# Altium schematic sheet Sheet1.SchDoc
size A3; SheetNumber: 1; SheetTotal: 1
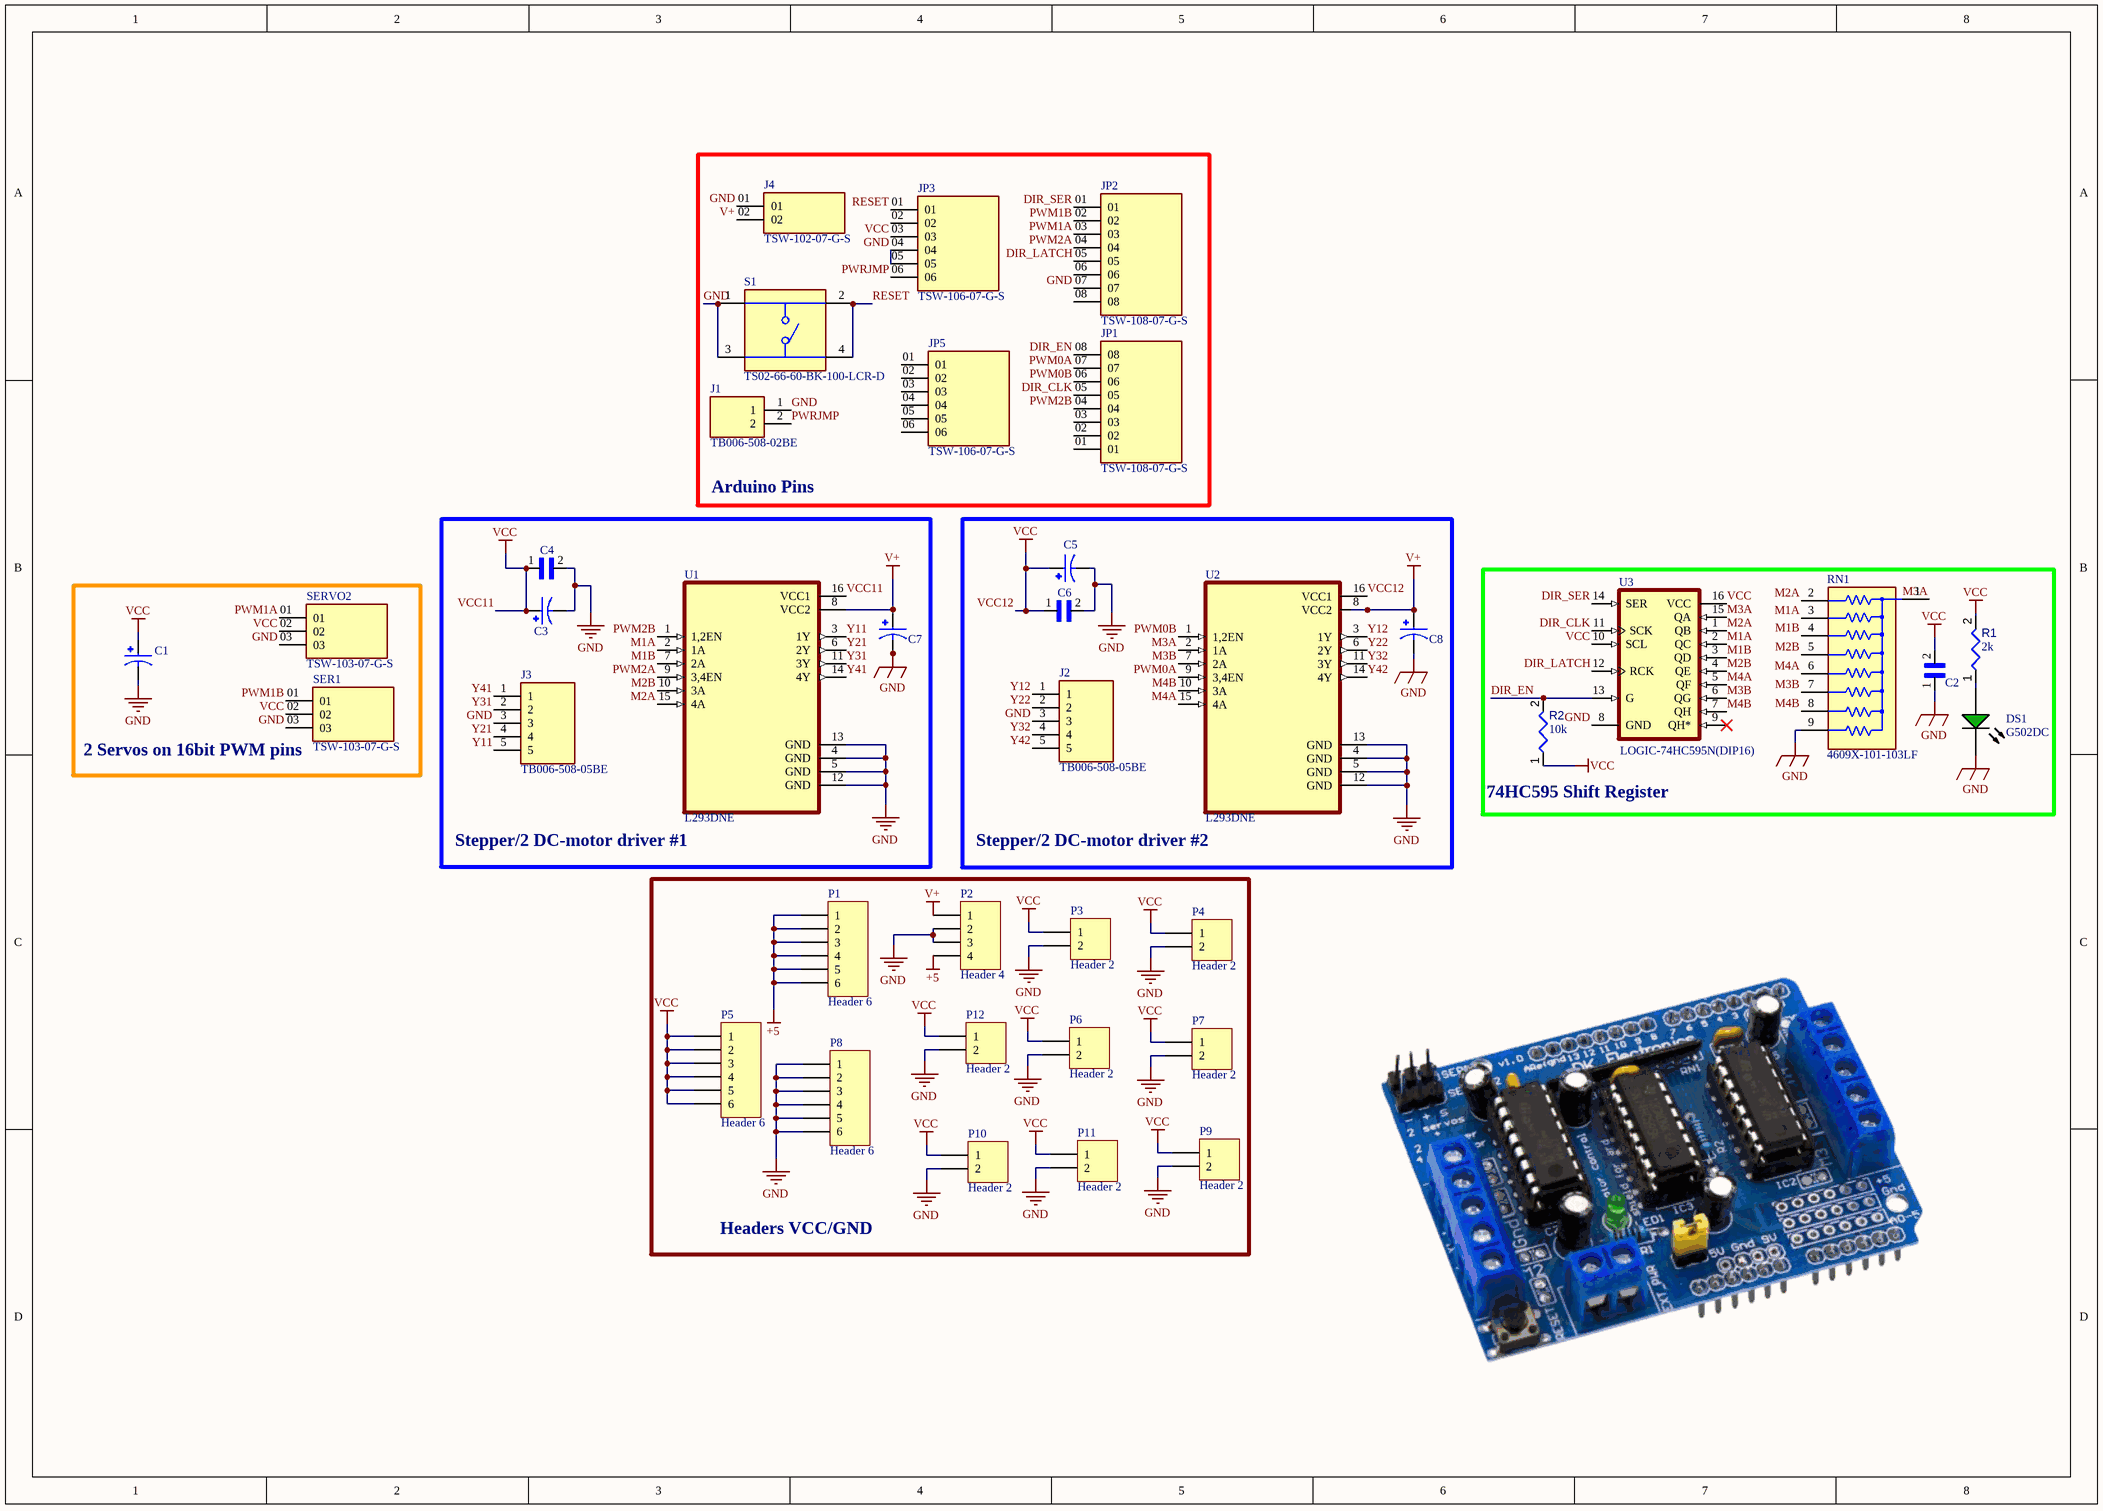
[diagram p0: Sheet1.SchDoc]

## Parts
C1  EEUFC1E101S  [CAPPRD250W50D630H1120]  (value not drawn)
C2  RCE5C1H104J2A2H03B  [CAP_RCE5C1H104J2A2H03B]  (value not drawn)
C3  EEUFC1E101S  [CAPPRD250W50D630H1120]  (value not drawn)
C4  RCE5C1H104J2A2H03B  [CAP_RCE5C1H104J2A2H03B]  (value not drawn)
C5  EEUFC1E101S  [CAPPRD250W50D630H1120]  (value not drawn)
C6  RCE5C1H104J2A2H03B  [CAP_RCE5C1H104J2A2H03B]  (value not drawn)
C7  EEUFC1E101S  [CAPPRD250W50D630H1120]  (value not drawn)
C8  EEUFC1E101S  [CAPPRD250W50D630H1120]  (value not drawn)
DS1  G502DC  [CGX-G502DC]
J1  TB006-508-02BE  [CUI_TB006-508-02BE]
J2  TB006-508-05BE  [CUI_TB006-508-05BE]
J3  TB006-508-05BE  [CUI_TB006-508-05BE]
J4  TSW-102-07-G-S  [SAMTEC_TSW-102-07-G-S]
JP1  TSW-108-07-G-S  [SAMTEC_TSW-108-07-G-S]
JP2  TSW-108-07-G-S  [SAMTEC_TSW-108-07-G-S]
JP3  TSW-106-07-G-S  [SAMTEC_TSW-106-07-G-S]
JP5  TSW-106-07-G-S  [SAMTEC_TSW-106-07-G-S]
P1  Header 6  [HDR1X6]
P2  Header 4  [HDR1X4]
P3  Header 2  [HDR1X2]
P4  Header 2  [HDR1X2]
P5  Header 6  [HDR1X6]
P6  Header 2  [HDR1X2]
P7  Header 2  [HDR1X2]
P8  Header 6  [HDR1X6]
P9  Header 2  [HDR1X2]
P10  Header 2  [HDR1X2]
P11  Header 2  [HDR1X2]
P12  Header 2  [HDR1X2]
R1  value 2k  [RESA60-630X240]  (hidden comment: MFR-25FBF52-10K)
R2  value 10k  [RESA60-630X240]  (hidden comment: MFR-25FBF52-10K)
RN1  4609X-101-103LF  [FP-4609X-MFG]
S1  TS02-66-60-BK-100-LCR-D  [SW_TS02-66-60-BK-100-LCR-D]
SER1  TSW-103-07-G-S  [SAMTEC_TSW-103-07-G-S]
SERVO2  TSW-103-07-G-S  [SAMTEC_TSW-103-07-G-S]
U1  L293DNE  [DIP762W45P254L1980H508Q16]
U2  L293DNE  [DIP762W45P254L1980H508Q16]
U3  LOGIC-74HC595N(DIP16)  [DIP16-2.54-20.32X5.84MM]

## Blocks framed on the sheet
Arduino Pins: J1 J4 JP1-JP3 JP5 S1
Stepper/2 DC-motor driver #1: C3 C4 C7 J3 U1
Stepper/2 DC-motor driver #2: C5 C6 C8 J2 U2
2 Servos on 16bit PWM pins: C1 SER1 SERVO2
74HC595 Shift Register: C2 DS1 R1 R2 RN1 U3
Headers VCC/GND: P1-P12

## Nets
+5: P1.1 P1.2 P1.3 P1.4 P1.5 P1.6 P2.4
GND: C1.N C2.1 C3.N C4.2 C5.N C6.2 C7.N C8.N DS1.2(K) J1.1 J2.3 J3.3 J4.01 JP2.07 JP3.04 JP3.05 P2.2 P2.3 P3.2 P4.2 P6.2 P7.2 P8.1 P8.2 P8.3 P8.4 P8.5 P8.6 P9.2 P10.2 P11.2 P12.2 RN1.9 S1.1 S1.3 SER1.03 SERVO2.03 U1.4(GND) U1.5(GND) U1.12(GND) U1.13(GND) U2.4(GND) U2.5(GND) U2.12(GND) U2.13(GND) U3.8(GND)
V+: C7.P C8.P J4.02 P2.1 U1.8(VCC2) U2.8(VCC2)
VCC: C1.P C2.2 C3.P C4.1 C5.P C6.1 JP3.03 P3.1 P4.1 P5.1 P5.2 P5.3 P5.4 P5.5 P5.6 P6.1 P7.1 P9.1 P10.1 P11.1 P12.1 R1.2 R2.1 SER1.02 SERVO2.02 U1.16(VCC1) U2.16(VCC1) U3.10(SCL) U3.16(VCC)  [also labelled VCC11, VCC12]
DIR_CLK: JP1.05 U3.11(SCK)
DIR_EN: JP1.08 R2.2 U3.13(G)
DIR_LATCH: JP2.05 U3.12(RCK)
DIR_SER: JP2.01 U3.14(SER)
M1A: RN1.3 U1.2(1A) U3.2(QC)
M1B: RN1.4 U1.7(2A) U3.3(QD)
M2A: RN1.2 U1.15(4A) U3.1(QB)
M2B: RN1.5 U1.10(3A) U3.4(QE)
M3A: RN1.1 U2.2(1A) U3.15(QA)
M3B: RN1.7 U2.7(2A) U3.6(QG)
M4A: RN1.6 U2.15(4A) U3.5(QF)
M4B: RN1.8 U2.10(3A) U3.7(QH)
PWM0A: JP1.07 U2.9(3,4EN)
PWM0B: JP1.06 U2.1(1,2EN)
PWM1A: JP2.03 SERVO2.01
PWM1B: JP2.02 SER1.01
PWM2A: JP2.04 U1.9(3,4EN)
PWM2B: JP1.04 U1.1(1,2EN)
PWRJMP: J1.2 JP3.06
RESET: JP3.01 S1.2 S1.4
Y11: J3.5 U1.3(1Y)
Y12: J2.1 U2.3(1Y)
Y21: J3.4 U1.6(2Y)
Y22: J2.2 U2.6(2Y)
Y31: J3.2 U1.11(3Y)
Y32: J2.4 U2.11(3Y)
Y41: J3.1 U1.14(4Y)
Y42: J2.5 U2.14(4Y)
NetDS1_1: DS1.1(A) R1.1

Not connected (* = marked no-connect by the designer): JP1 01 02 03; JP2 06 08; JP3 02; JP5 01 02 03 04 05 06; U3 9(QH*)*

## Library data of the parts
C1 C3 C5 C7 C8 = EEUFC1E101S: FC-A; Price: None; Value: *; MP: EEUFC1E101S; Package: None; Availability: Unavailable
C2 C4 C6 = RCE5C1H104J2A2H03B: Multilayer Ceramic Capacitors MLCC - Leaded; Package: None; Price: None; Value: *; MP: RCE5C1H104J2A2H03B; Availability: Unavailable
DS1 = CMP-007-00008-2: Green LED, 80 mW, 20 mA, -25 to 85 degC, 2-Pin THD; Manufacturer: Shenzhen CGX; Mounting Technology: TH; Package Reference: G502DC; Datasheet Version: Sep-14; Manufacturer URL: http://szcgx.com/; Package Description: 2-Pin Through Hole Device, Dia 5.9 mm; Datasheet URL: http://datasheet.octopart.com/G502DC-Chengguangxing-datasheet-62330340.pdf; Case/Package: G502DC; RoHS Compliant: Unknown
J1 = TB006-508-02BE: 2~24 Poles, Screw Type, Horizontal, 5.08 Pitch, 26~14 (AWG), Terminal Block Connector; MF: Same Sky; SnapEDA_Link: https://www.snapeda.com/parts/TB006-508-02BE/Same+Sky/view-part/?ref=snap; Package: None; Value: *; MP: TB006-508-02BE; Check_prices: https://www.snapeda.com/parts/TB006-508-02BE/Same+Sky/view-part/?ref=eda
J2 J3 = TB006-508-05BE: 2~24 Poles, Screw Type, Horizontal, 5.08 Pitch, 26~14 (AWG), Terminal Block Connector; MF: Same Sky; SnapEDA_Link: https://www.snapeda.com/parts/TB006-508-05BE/Same+Sky/view-part/?ref=snap; Package: None; Value: *; MP: TB006-508-05BE; Check_prices: https://www.snapeda.com/parts/TB006-508-05BE/Same+Sky/view-part/?ref=eda
J4 = TSW-102-07-G-S: MF: Samtec; Package: None; Price: None; Value: *; MP: TSW-102-07-G-S; Availability: Unavailable
JP1 JP2 = TSW-108-07-G-S: MF: Samtec; Availability: Unavailable; Package: None; MP: TSW-108-07-G-S; Value: *; Price: None
JP3 JP5 = TSW-106-07-G-S: MF: Samtec Inc.; Value: *; Availability: Unavailable; Price: None; Package: None; MP: TSW-106-07-G-S
P1 P5 P8 = CMP-002-00178-1: Header, 6-Pin; Signal Integrity: Connector; Design Item ID: Header 6; LatestRevisionNote: Re-released for DXP Platform.; Component Type: Standard; Source: Miscellaneous Connectors.SchLib; LatestRevisionDate: 17-Jul-2002; Pins: 6; Publisher: Altium Limited
P2 = CMP-002-00168-1: Header, 4-Pin; Signal Integrity: Connector; LatestRevisionDate: 17-Jul-2002; Publisher: Altium Limited; Source: Miscellaneous Connectors.SchLib; Component Type: Standard; Design Item ID: Header 4; LatestRevisionNote: Re-released for DXP Platform.; Pins: 4
P3 P4 P6 P7 P9-P12 = CMP-002-00141-1: Header, 2-Pin; Signal Integrity: Connector; LatestRevisionDate: 17-Jul-2002; Pins: 2; Design Item ID: Header 2; Component Type: Standard; Source: Miscellaneous Connectors.SchLib; LatestRevisionNote: Re-released for DXP Platform.; Publisher: Altium Limited
R1 R2 = CMP-009-00047-4: Axial Resistor, 10 KOhm, +/- 1%, 0.25 W, -55 to 155 degC, 2-Pin THD, RoHS, Bulk; Manufacturer: Yageo; Power: 250mW; Voltage Rating: 250V; Manufacturer URL: http://www.yageo.com/; Datasheet URL: http://www.yageo.com/documents/recent/Yageo%20LR_MFR_2013.pdf; Package Reference: MFR-25; Min Operating Temperature: -55°C; Mounting Technology: TH; Package Quantity: 200; Case/Package: Axial; Tolerance: 1%; RoHS Compliant: True; Datasheet Version: Apr-13; Packaging: Bulk; Max Operating Temperature: 155°C; Package Description: 2-Pin Axial Lead, Dia 2.4 mm, Body Length 6.3 mm
RN1 = CMP-2000-05605-2: RES ARRAY 8 RES 10K OHM 9SIP; Power Per Element: 200mW; Power Rating: 1.13W; Number of Resistors: 8; Voltage Rating: 100V; Resistance Tolerance: 2%; Lead Length: 3.43mm; Circuit Type: Bussed; Temperature Coefficient: 100ppm/°C; Insulation Resistance: 10MR; Number of Terminals/Pins: 9; Resistance: 10kR; Contact Plating: Copper; Number of Elements: 8; Min Operating Temperature: -55°C; Termination: Pin; Series: 4600X; Lead Pitch: 2.49mm; Packaging: Bulk; Technology: THICK FILM; Case/Package: SIP; Depth: 2.49mm; Length: 22.81mm; Width: 0.098inch; Tolerance: 2%; Terminal Pitch: 2.54mm; Height: 0.2inch; Mount: Through Hole; Radiation Hardening: No; RoHS Compliant: Yes; Max Operating Temperature: 125°C; Military Standard: Not; Number of Pins: 9; REACH SVHC: No SVHC; Package Quantity: 200
S1 = TS02-66-60-BK-100-LCR-D: 6 x 6 mm, 6 mm Actuator Height, 100 gf, Black, Long Crimped, Through Hole, SPST, Tactile Switch; MF: Same Sky; SnapEDA_Link: https://www.snapeda.com/parts/TS02-66-60-BK-100-LCR-D/Same+Sky/view-part/?ref=snap; Package: None; Value: *; MP: TS02-66-60-BK-100-LCR-D; Check_prices: https://www.snapeda.com/parts/TS02-66-60-BK-100-LCR-D/Same+Sky/view-part/?ref=eda
SER1 SERVO2 = TSW-103-07-G-S: MF: Samtec; Value: *; Availability: Unavailable; Price: None; Package: None; MP: TSW-103-07-G-S
U1 U2 = L293DNE: Quadruple Half-H Drivers; MF: Texas Instruments; SnapEDA_Link: https://www.snapeda.com/parts/L293DNE/Texas+Instruments/view-part/?ref=snap; Package: PDIP-16 Texas Instruments; Value: *; MP: L293DNE; Check_prices: https://www.snapeda.com/parts/L293DNE/Texas+Instruments/view-part/?ref=eda
U3 = LOGIC-74HC595N(DIP16): Shift Shift Register 1 Element 8 Bit 16-PDIP; MF: Texas Instruments; Check_prices: https://www.snapeda.com/parts/74HC595N/Texas+Instruments/view-part/?ref=eda; Value: *; Availability: In Stock; MP: 74HC595N; Price: None; Package: SOT38-4-16 Nexperia; SnapEDA_Link: https://www.snapeda.com/parts/74HC595N/Texas+Instruments/view-part/?ref=snap; Purchase-URL: https://pricing.snapeda.com/search/part/74HC595N/?ref=eda